# EAGLE design WaterMonitor (EAGLE 7.4.0)
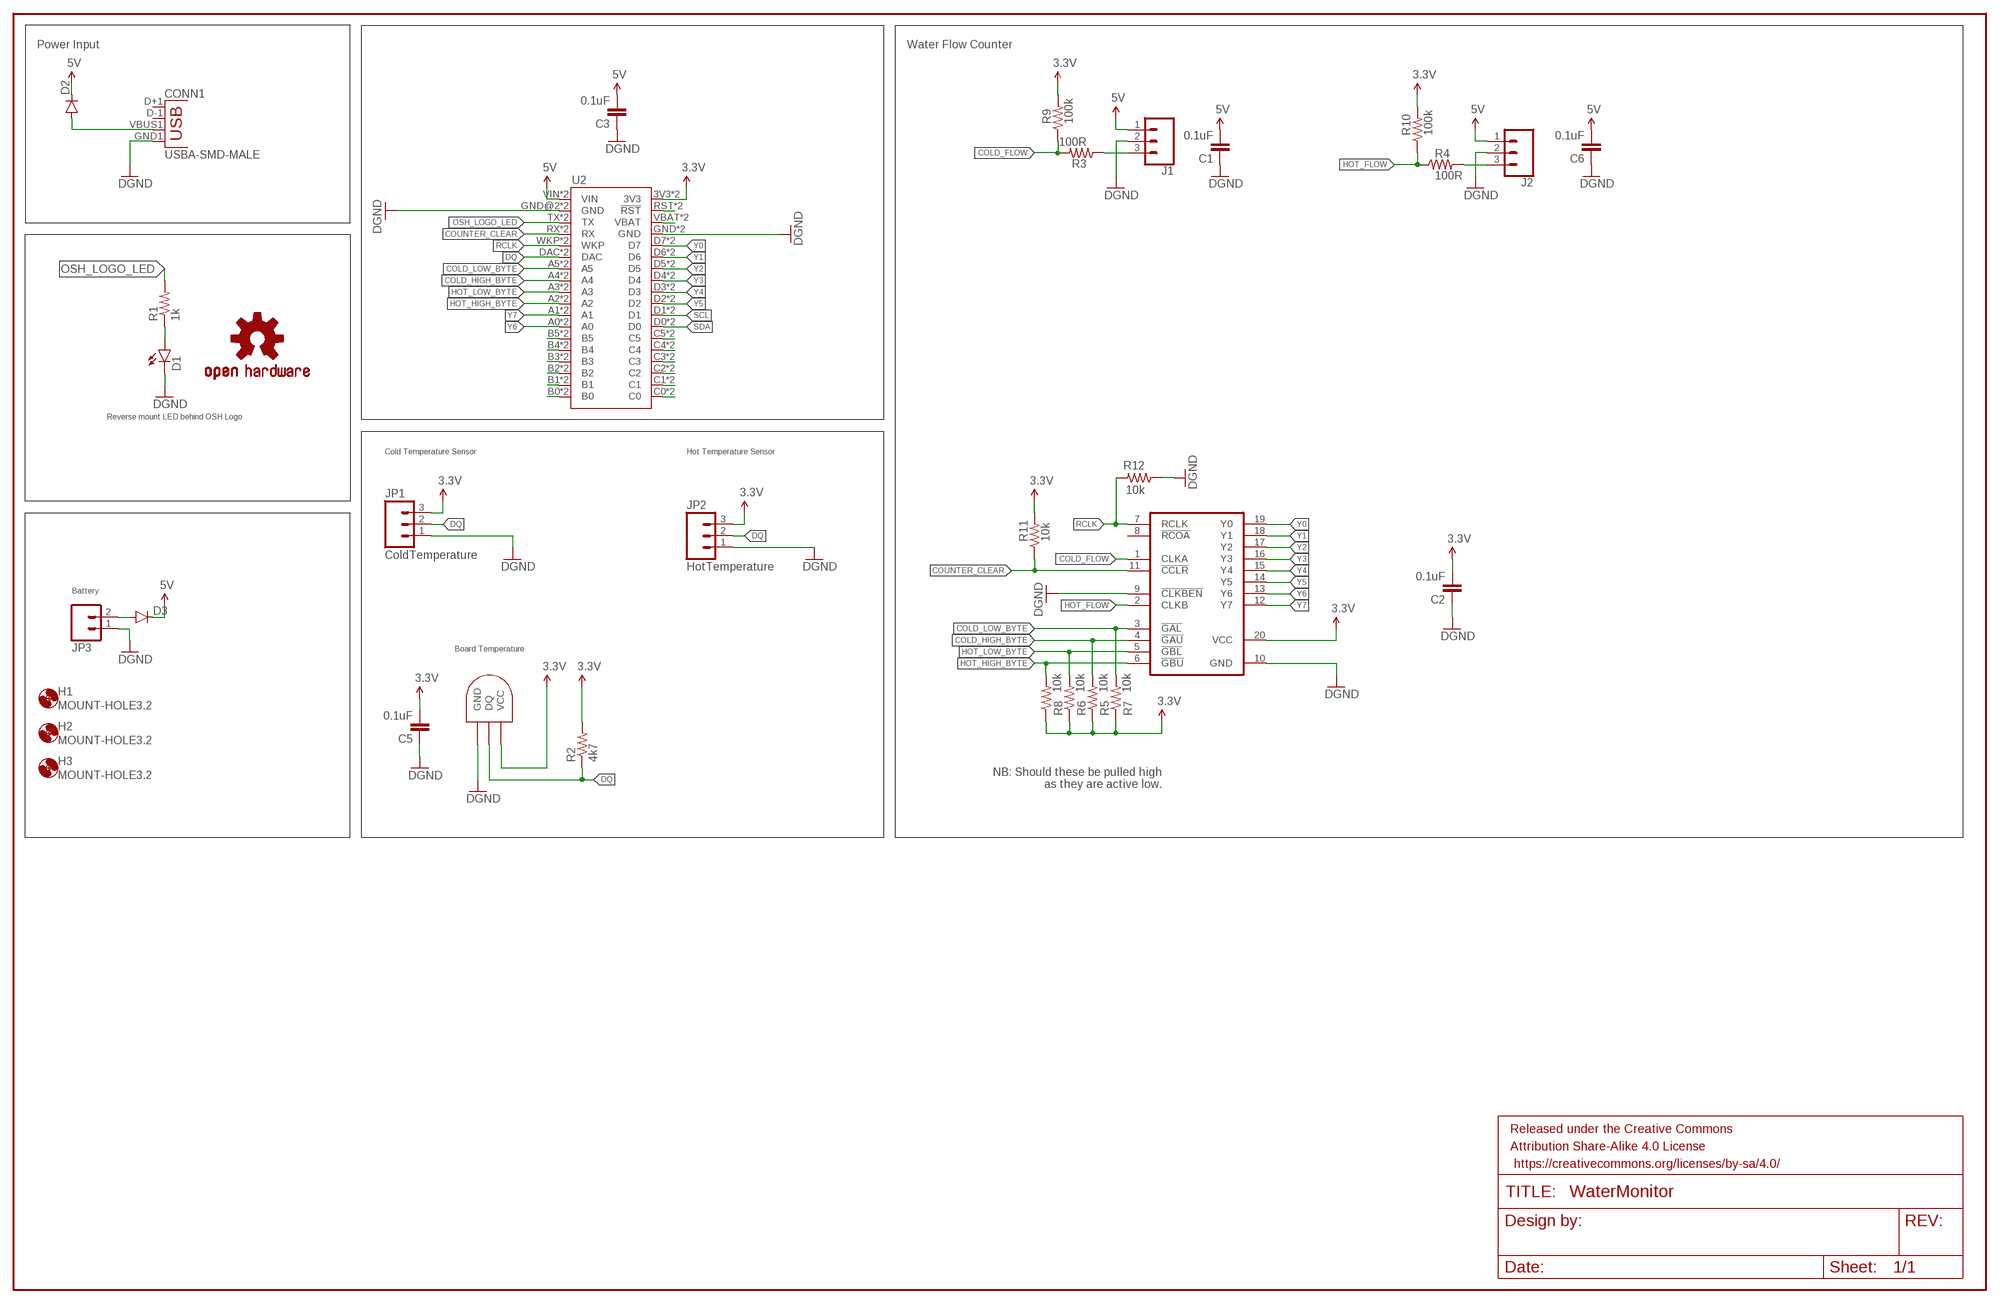
[diagram p0: schematic, sheet 1]

## Parts
C1  0.1uF  CAP0805  [0805]
C2  0.1uF  CAP0805  [0805]
C3  0.1uF  CAP0805  [0805]
C5  0.1uF  CAP0805  [0805]
C6  0.1uF  CAP0805  [0805]
CONN1  USBA-SMD-MALE  [USB-A-SMT-MALE]
D1  LED1206-BOTTOM  [LED-1206-BOTTOM]
D2  DIODESMA  [SMA-DIODE]
D3  DIODESMA  [SMA-DIODE]
FRAME2  FRAME-LEDGER  [CREATIVE_COMMONS]
H1  MOUNT-HOLE3.2  [3,2]
H2  MOUNT-HOLE3.2  [3,2]
H3  MOUNT-HOLE3.2  [3,2]
J1  CONN_03JST-HX-PTH-VERT  [JST-HX-3-PTH-VERT]
J2  CONN_03JST-HX-PTH-VERT  [JST-HX-3-PTH-VERT]
JP1  ColdTemperature  M03POLAR  [MOLEX-1X3]
JP2  HotTemperature  M03POLAR  [MOLEX-1X3]
JP3  M02-JST-2MM-SMT  [JST-2-SMD]
LOGO1  OSHW-LOGOM  [OSHW-LOGO-M]
R1  1k  RESISTOR1206  [1206]
R2  4k7  RESISTOR0805-RES  [0805]
R3  100R  RESISTOR0805-RES  [0805]
R4  100R  RESISTOR0805-RES  [0805]
R5  10k  RESISTOR0805-RES  [0805]
R6  10k  RESISTOR0805-RES  [0805]
R7  10k  RESISTOR0805-RES  [0805]
R8  10k  RESISTOR0805-RES  [0805]
R9  100k  RESISTOR0805-RES  [0805]
R10  100k  RESISTOR0805-RES  [0805]
R11  10k  RESISTOR0805-RES  [0805]
R12  10k  RESISTOR0805-RES  [0805]
U1  SN74LV8154PW  [TSSOP20]
U2  ELECTRONDUALNAMED  [ELECTRON_SIMPLE_SILK_NAMES_DUAL]
U4  DS1820SOIC  [DS18B20_SOIC]

## Nets
3.3V: C2.2 C5.2 JP1.3 JP2.3 R2.2 R5.1 R6.1 R7.1 R8.1 R9.2 R10.2 R11.2 U1.20(VCC) U2.3V3 U2.3V3_1(3V3) U4.VCC
5V: C1.2 C3.2 C6.2 D2.C D3.C J1.1 J2.1 U2.VIN U2.VIN_1B(VIN)
COLD_FLOW: R3.2 R9.1 U1.1(CLKA)
COLD_HIGH_BYTE: R5.2 U1.4(!GAU!) U2.A4 U2.A4_1(A4)
COLD_LOW_BYTE: R7.2 U1.3(!GAL!) U2.A5 U2.A5_1(A5)
COUNTER_CLEAR: R11.1 U1.11(!CCLR!) U2.RX U2.RX_1(RX)
DQ: JP1.2 JP2.2 R2.1 U2.DAC U2.DAC_1(DAC) U4.DQ
GND: C1.1 C2.1 C3.1 C5.1 C6.1 CONN1.GND1(GND) D1.C J1.2 J2.2 JP1.1 JP2.1 JP3.1 R12.1 U1.9(!CLKBEN!) U1.10(GND) U2.GND U2.GND@2(GND) U2.GND_1(GND) U2.GND_1B(GND) U4.GND ; supply symbol labelled DGND
HOT_FLOW: R4.1 R10.1 U1.2(CLKB)
HOT_HIGH_BYTE: R8.2 U1.6(!GBU!) U2.A2 U2.A2_1(A2)
HOT_LOW_BYTE: R6.2 U1.5(!GBL!) U2.A3 U2.A3_1(A3)
N$1: CONN1.VBUS1(VBUS) D2.A
N$3: J1.3 R3.1
N$4: J2.3 R4.2
N$6: U2.VBAT U2.VBATT_1(VBAT)
N$7: U2.RST(!RST) U2.RST_1(!RST)
N$21: D1.A R1.1
N$22: U2.C1 U2.C1_1(C1)
N$23: U2.C5 U2.C5_1(C5)
N$24: U2.C4 U2.C4_1(C4)
N$25: U2.C3 U2.C3_1(C3)
N$26: U2.C2 U2.C2_1(C2)
N$27: U2.C0 U2.C0_1(C0)
N$29: D3.A JP3.2
N$31: U2.B0 U2.B0_1(B0)
N$33: U2.B1 U2.B1_1(B1)
N$35: U2.B2 U2.B2_1(B2)
N$36: U2.B3 U2.B3_1(B3)
N$37: U2.B4 U2.B4_1(B4)
N$38: U2.B5 U2.B5_1(B5)
OSH_LOGO_LED: R1.2 U2.TX U2.TX_1(TX)
RCLK: R12.2 U1.7(RCLK) U2.WKP U2.WKP_1(WKP)
SCL: U2.D1 U2.D1_1(D1)
SDA: U2.D0 U2.D0_1(D0)
Y0: U1.19(Y0) U2.D7 U2.D7_1(D7)
Y1: U1.18(Y1) U2.D6 U2.D6_1(D6)
Y2: U1.17(Y2) U2.D5 U2.D5_1(D5)
Y3: U1.16(Y3) U2.D4 U2.D4_1(D4)
Y4: U1.15(Y4) U2.D3 U2.D3_1(D3)
Y5: U1.14(Y5) U2.D2 U2.D2_1(D2)
Y6: U1.13(Y6) U2.A0 U2.A0_1(A0)
Y7: U1.12(Y7) U2.A1 U2.A1_1(A1)
Unconnected: CONN1.D+1(D+) CONN1.D-1(D-) U1.8(!RCOA!)

## Notes on the sheet
- Power Input | Water Flow Counter
- Reverse mount LED behind OSH Logo
- Cold Temperature Sensor | Hot Temperature Sensor
- Battery
- Board Temperature
- NB: Should these be pulled high
  as they are active low.

## Library data of the parts
C1-C3 C5 C6 = SparkFun-Passives:CAP: Capacitor Standard 0603 ceramic capacitor, and 0.1" leaded capacitor.
CONN1 = SparkFun-Connectors:USB: USB Connectors USB-B-PTH is fully proven SKU : PRT-00139/CONN-08278 USB-miniB is fully proven SKU : PRT-00587 USB-A-PCB is untested. USB-A-H is throughly reviewed, but untested. Spark Fun Electronics SKU : PRT-00437 USB-B-SMT is throughly reviewed, but untested. Needs silkscreen touching up. USB-A-S has not been used/tested USB-MB-H has not been used/tested USB-MICROB has been used. CONN-09505
D1 = SparkFun-LED:LED: LEDs Standard schematic elements and footprints for 5mm, 3mm, 1206, and 0603 sized LEDs. 5mm - Spark Fun Electronics SKU : COM-00529 (and others)
D2 D3 = SparkFun-DiscreteSemi:DIODE: Diode These are standard reverse protection diodes and small signal diodes. SMA package can handle up to about 1A. SOD-323 can handle about 200mA. What the SOD-323 package when ordering, there are some mfgs out there that are 5-pin packages.
FRAME2 = SparkFun-Aesthetics:FRAME-LEDGER: Schematic Frame Standard 11x14 US Ledger frame
H1-H3 = holes:MOUNT-HOLE: MOUNTING HOLE with drill center marker
J1 J2 = Tinamous:CONN_03: Multi connection point. Often used as Generic Header-pin footprint for 0.1 inch spaced/style header connections On any of the 0.1 inch spaced packages, you can populate with these: Break Away Headers - Straight <https://www.sparkfun.com/products/116> (PRT-00116) Break Away Male Headers - Right Angle <https://www.sparkfun.com/products/553> (PRT-00553) Female Headers <https://www.sparkfun.com/products/115> (PRT-00115) Break Away Headers - Machine Pin <https://www.sparkfun.com/products/117> (PRT-00117) Break Away Female Headers - Swiss Machine Pin <https://www.sparkfun.com/products/743> (PRT-00743) Stackable Header - 3 Pin (Female, 0.1") <https://www.sparkfun.com/products/13875> (PRT-13875) For SCREWTERMINALS and SPRING TERMINALS visit here: Screw Terimnals on SparkFun.com <https://www.sparkfun.com/search/results?term=Screw+Terminals> (5mm/3.5mm/2.54mm spacing) This device is also useful as a general connection point to wire up your design to another part of your project. Our various solder wires solder well into these plated through hole pads. Hook-Up Wire - Assortment (Stranded, 22 AWG) <https://www.sparkfun.com/products/11375> (PRT-11375) Hook-Up Wire - Assortment (Solid Core, 22 AWG) <https://www.sparkfun.com/products/11367> (PRT-11367) View the entire wire category on our website here <https://www.sparkfun.com/categories/141> Special notes: Molex polarized connector foot print use with SKU : PRT-08232 with associated crimp pins and housings.
JP1 JP2 = SparkFun-Connectors:M03: Header 3 Standard 3-pin 0.1" header. Use with straight break away headers (SKU : PRT-00116), right angle break away headers (PRT-00553), swiss pins (PRT-00743), machine pins (PRT-00117), and female headers (PRT-00115). Molex polarized connector foot print use with SKU : PRT-08232 with associated crimp pins and housings.
JP3 = SparkFun-Connectors:M02: Standard 2-pin 0.1" header. Use with - straight break away headers ( PRT-00116) - right angle break away headers (PRT-00553) - swiss pins (PRT-00743) - machine pins (PRT-00117) - female headers (PRT-00115) Molex polarized connector foot print use with: PRT-08233 with associated crimp pins and housings. 2.54_SCREWTERM for use with PRT-10571. 3.5mm Screw Terminal footprints for PRT-08084 5mm Screw Terminal footprints for use with PRT-08432; PROD_ID: CONN-11443
LOGO1 = SparkFun-Aesthetics:OSHW-LOGO: Open Source Hardware Logo This logo indicates the piece of hardware it is found on incorporates a OSHW license and/or adheres to the definition of open source hardware found here: http://freedomdefined.org/OSHW
R1-R12 = SparkFun-Resistors:RESISTOR: Resistor Basic schematic elements and footprints for 0603, 1206, and PTH resistors.
U1 = SN74LV8154:SN74LV8154
U2 = Tinamous:ELECTRON
U4 = DS1820-SOIC:DS1820

## Board
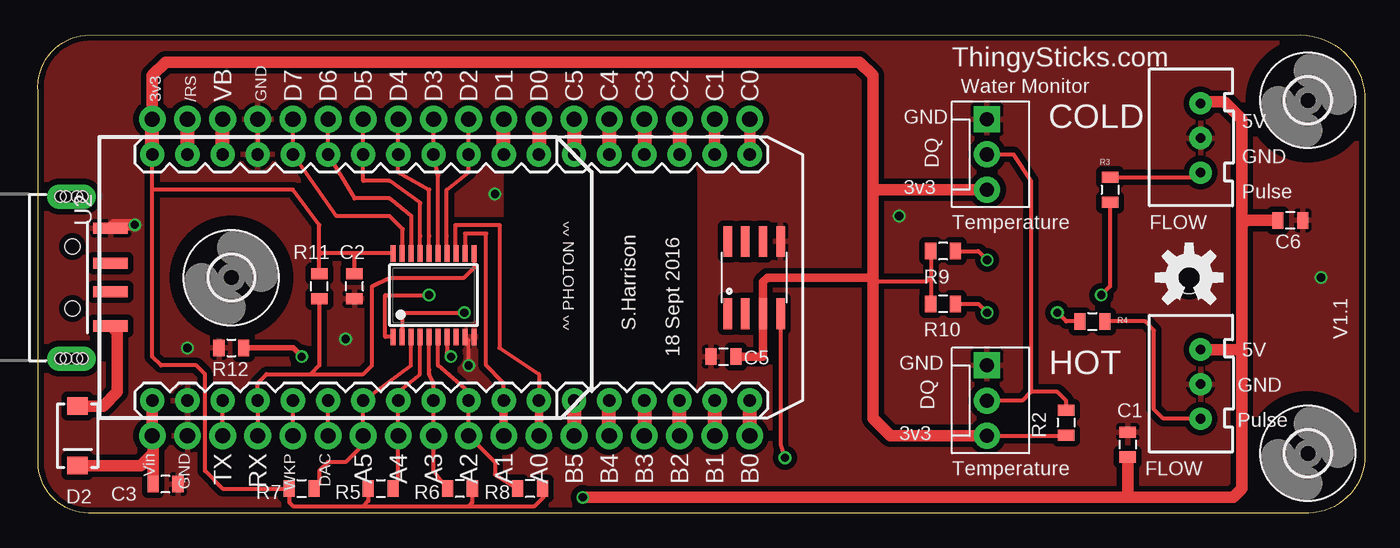
[diagram p1: board, top side]
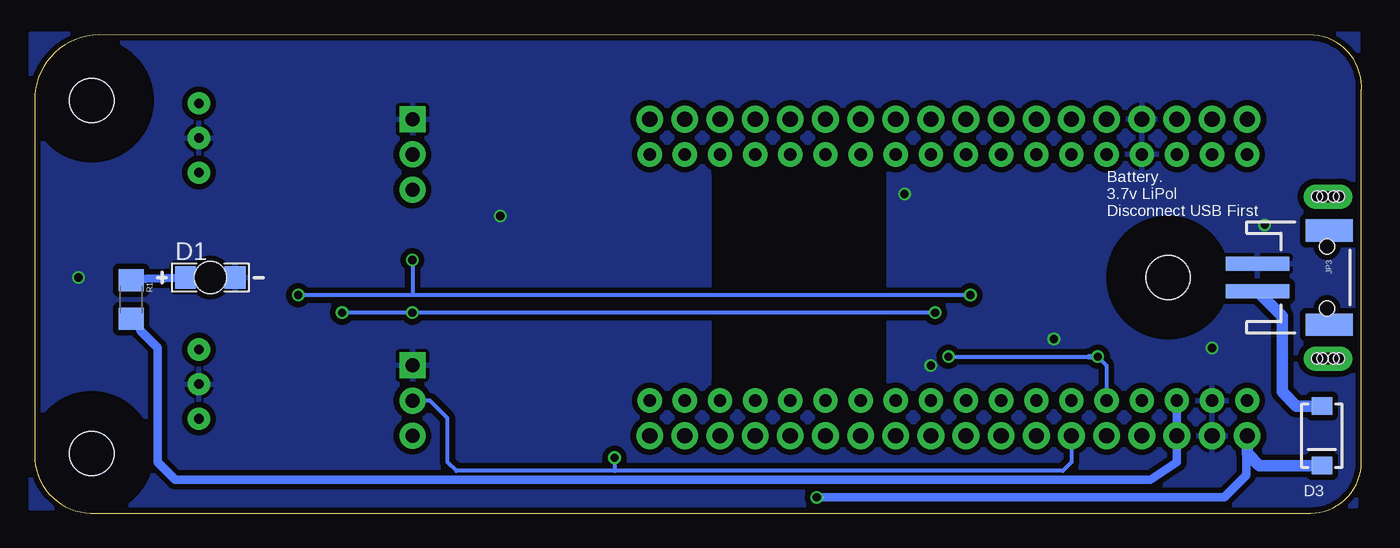
[diagram p2: board, bottom side, seen from below]

Size 95.9 x 34.56 mm. Coordinates in mm from the lower left corner, seen from the top.
Outline: 3.44,34.52 91.27,34.56 arc-90 95.9,29.71 95.9,4.19 arc-90 91.84,0 3.69,0 arc-90 0.01,3.67 0.01,30.46 arc-90 3.44,34.52
Copper layers (1*16): Top 0.035mm / dielectric 1.5mm / Bottom 0.035mm
Design rules "dirt_cheap_dirty_boards.v1": minimum track width 5mil, minimum drill 12mil, track to track 5mil, track to pad 5mil, pad to pad 5mil, via to via 5mil, smd to smd 0mil, copper to edge 10mil, drill to drill 10mil, minimum pad ring 10mil, minimum via ring 6mil, stop-mask expansion 2mil, vias tented up to drill 25mil, thermal gap 10mil
tRestrict: area 34.3,6.8 to 47,27.2
bRestrict: area 34.9,6.8 to 46.4,27.2

### Footprints (pad centres in the part's own frame; a part is rotated, then mirrored left to right if it is on the bottom)
0805 = smd 0.8 x 1.2: 1 -0.9,0; 2 0.9,0
USB-A-SMT-MALE = smd 0.8 x 2.5: D+1 1.027,-5.87; D-1 -1.027,-5.87; GND1 3.551,-5.87; VBUS1 -3.5,-5.87 | drill 0.8 pad 1.778 long: P$1 5.85,-3.05; P$3 -5.85,-3.05 | hole 1.1: 2.25,-3.12; -2.25,-3.12 | hole 0.8: -5.85,-3.45; -5.85,-3.85; -5.85,-2.65; -5.85,-2.25; 5.85,-3.45; 5.85,-3.85; 5.85,-2.65; 5.85,-2.25
LED-1206-BOTTOM = smd 1.5 x 1.6: A -1.8,0; C 1.8,0 | hole 2.3: 0,0
SMA-DIODE = smd 1.27 x 1.47: A -2.15,0; C 2.15,0
3,2 = hole 3.2: 0,0
JST-HX-3-PTH-VERT = drill 0.7 pad 1.6: 1 7.5,2.35; 2 5,2.35; 3 2.5,2.35
MOLEX-1X3 = drill 1.016 pad 1.88 square: 1 0,0 | drill 1.016 pad 1.88: 2 2.54,0; 3 5.08,0
JST-2-SMD = smd 1 x 4.6: 1 -1,-3.7; 2 1,-3.7 | smd 1.6 x 3.4: NC1 -3.4,1.5; NC2 3.4,1.5
1206 = smd 1.6 x 1.8: 1 -1.4,0; 2 1.4,0
TSSOP20 = smd 0.35 x 1.2: 1 -2.925,-3.018; 2 -2.275,-3.018; 3 -1.625,-3.018; 4 -0.975,-3.018; 5 -0.325,-3.018; 6 0.325,-3.018; 7 0.975,-3.018; 8 1.625,-3.018; 9 2.275,-3.018; 10 2.925,-3.018; 11 2.925,3.018; 12 2.275,3.018; 13 1.625,3.018; 14 0.975,3.018; 15 0.325,3.018; 16 -0.325,3.018; 17 -0.975,3.018; 18 -1.625,3.018; 19 -2.275,3.018; 20 -2.925,3.018
ELECTRON_SIMPLE_SILK_NAMES_DUAL = drill 0.889 pad 1.753: 3V3 1.27,22.86; A0 29.21,5.08; A1 26.67,5.08; A2 24.13,5.08; A3 21.59,5.08; A4 19.05,5.08; A5 16.51,5.08; B0 44.45,5.08; B1 41.91,5.08; B2 39.37,5.08; B3 36.83,5.08; B4 34.29,5.08; B5 31.75,5.08; C0 44.45,22.86; C1 41.91,22.86; C2 39.37,22.86; C3 36.83,22.86; C4 34.29,22.86; C5 31.75,22.86; D0 29.21,22.86; D1 26.67,22.86; D2 24.13,22.86; D3 21.59,22.86; D4 19.05,22.86; D5 16.51,22.86; D6 13.97,22.86; D7 11.43,22.86; DAC 13.97,5.08; GND 8.89,22.86; GND@2 3.81,5.08; RST 3.81,22.86; RX 8.89,5.08; TX 6.35,5.08; VBAT 6.35,22.86; VIN 1.27,5.08; WKP 11.43,5.08 | drill 1.1 pad 1.93: 3V3_1 1.27,25.4; A0_1 29.21,2.54; A1_1 26.67,2.54; A2_1 24.13,2.54; A3_1 21.59,2.54; A4_1 19.05,2.54; A5_1 16.51,2.54; B0_1 44.45,2.54; B1_1 41.91,2.54; B2_1 39.37,2.54; B3_1 36.83,2.54; B4_1 34.29,2.54; B5_1 31.75,2.54; C0_1 44.45,25.4; C1_1 41.91,25.4; C2_1 39.37,25.4; C3_1 36.83,25.4; C4_1 34.29,25.4; C5_1 31.75,25.4; D0_1 29.21,25.4; D1_1 26.67,25.4; D2_1 24.13,25.4; D3_1 21.59,25.4; D4_1 19.05,25.4; D5_1 16.51,25.4; D6_1 13.97,25.4; D7_1 11.43,25.4; DAC_1 13.97,2.54; GND_1 8.89,25.4; GND_1B 3.81,2.54; RST_1 3.81,25.4; RX_1 8.89,2.54; TX_1 6.35,2.54; VBATT_1 6.35,25.4; VIN_1B 1.27,2.54; WKP_1 11.43,2.54
DS18B20_SOIC = smd 0.61 x 2.21: DQ 1.905,-2.616; GND 1.905,2.616; NC -1.905,-2.616; NC2 -0.635,-2.616; NC3 -1.905,2.616; NC4 -0.635,2.616; NC5 0.635,2.616; VCC 0.635,-2.616

### Placement (x,y rotation side)
C1  78.75,4.94 270 top
C2  22.87,16.38 90 top
C3  9.22,2.09 180 top
C5  49.54,11.29 0 top
C6  90.5,21.14 180 top
CONN1  -0.62,17.01 90 top
D1  83.2,17.01 0 bottom
D2  2.87,5.58 270 top
D3  2.87,5.58 270 bottom
FRAME2  16.52,-17.92 0 top  (outside the outline)
H1  13.98,17.01 0 top
H2  91.77,4.31 0 top
H3  91.77,29.81 0 top
J1  86.37,22.09 90 top
J2  86.37,4.31 90 top
JP1  68.59,28.44 270 top
JP2  68.59,10.66 270 top
JP3  3.82,17.01 270 bottom
LOGO1  83.2,17.01 0 top
R1  88.91,15.42 270 bottom
R2  74.31,6.53 270 top
R3  77.48,23.36 270 top
R4  76.21,13.84 0 top
R5  24.78,1.77 0 top
R6  30.49,1.77 180 top
R7  19.06,1.77 0 top
R8  35.57,1.77 180 top
R9  65.42,18.91 180 top
R10  65.42,15.11 180 top
R11  20.33,16.38 90 top
R12  13.98,11.93 0 top
U1  28.59,15.74 0 top
U2  7,3.04 0 top
U4  51.77,17.01 0 top

### Tracks (layer width: path | path; a pad name or v marks a point on that pad's centre or on a via)
3.3V
  Top 0.305: 8.27,23.36 18.43,23.36 20.33,20.82 20.33,18.91 | JP2.3 74.31,5.58 R2.2 | 8.27,24.63 U2.3V3 8.27,23.36 | R9.2 64.52,17.01 | 64.52,17.01 R10.2 | 60.34,16.75 64.25,16.75 64.52,17.01 | R11.2 20.33,18.91 | 8.27,23.36 8.27,11.29 8.9,10.66 11.44,10.66 12.08,10.02 12.08,3.04 13.35,1.77 R7.1 18.16,0.76 18.43,0.5 23.51,0.5 | 23.51,0.5 31.13,0.5 | 31.13,0.5 35.89,0.5 36.53,1.13 36.53,1.72 R8.1 | R6.1 31.39,0.76 31.13,0.5 | R5.1 23.88,0.87 23.51,0.5 | U1.20 22.87,18.76 | 22.87,18.76 20.49,18.76 20.33,18.91 | C2.2 22.87,18.76
  Top 0.61: C5.2 52.4,11.29 U4.VCC 52.4,16.69 52.72,17.01 60.34,17.01
  Top 0.813: U2.3V3_1 8.27,31.61 9.22,32.57 59.39,32.57 60.34,31.61 60.34,23.36 | JP1.3 60.34,23.36 | 60.34,23.36 60.34,17.01 60.34,16.75 60.34,6.85 61.61,5.58 JP2.3
  Top 1.016: U2.3V3 U2.3V3_1
5V  (via drill 0.6)
  Top 0.813: 8.32,4.31 8.32,4.36 U2.VIN_1B U2.VIN | D3.C 7.44,3.43 8.32,4.31 | 87.01,20.82 87.01,28.44 85.74,29.71 84.14,29.71 J1.1 | 87.01,20.82 87.01,11.93 | 87.01,11.93 87.01,1.77 86.37,1.13 78.75,1.13 | 78.75,1.13 v39.38,1.13 | 8.32,4.31 C3.2 | C6.2 87.33,21.14 87.01,20.82 | C1.2 78.75,1.13 | J2.1 86.89,11.81 87.01,11.93
  Bottom 0.61: v39.38,1.13 9.91,1.13 8.32,2.72 8.32,5.53 U2.VIN_1B
  Bottom 0.813: D3.C 7.39,3.43 8.27,4.31 U2.VIN_1B
COLD_FLOW  (via drill 0.6)
  Top 0.305: U1.1 25.1,12.72 25.1,15.74 v28.27,15.74 | R9.1 67.96,18.91 v68.59,18.28 | R3.2 77.48,16.38 v76.85,15.74
  Bottom 0.305: v28.27,15.74 68.59,15.74 | 68.59,15.74 v76.85,15.74 | v68.59,18.28 68.59,15.74
COLD_HIGH_BYTE
  Top 0.305: U1.4 27.61,10.02 26.05,8.75 U2.A4 U2.A4_1 26.05,2.4 R5.2
COLD_LOW_BYTE
  Top 0.305: U1.3 26.96,10.66 U2.A5 U2.A5_1 23.51,4.94 22.24,3.67 20.97,3.67 20.33,3.04 20.33,2.14 R7.2
COUNTER_CLEAR
  Top 0.305: U2.RX_1 U2.RX 15.89,9.39 16.52,10.02 19.7,10.02 | 19.7,10.02 23.51,10.02 24.14,10.66 24.14,16.38 25.41,17.01 30.81,17.01 31.51,17.71 U1.11 | R11.1 20.33,10.66 19.7,10.02
DQ  (via drill 0.6)
  Top 0.305: JP1.2 70.5,25.9 71.77,23.99 71.77,8.75 | 71.77,8.75 71.13,8.12 JP2.2 | U2.DAC_1 U2.DAC | U4.DQ 53.67,4.94 v53.99,3.99 | R2.1 74.31,8.12 73.67,8.75 71.77,8.75
  Bottom 0.305: U2.DAC_1 20.97,3.67 21.6,3.04 53.99,3.04 | 53.99,3.04 65.42,3.04 66.05,3.67 66.05,6.85 67.32,8.12 JP2.2 | v53.99,3.99 53.99,3.04
GND  (via drill 0.6)
  Top 0.305: U2.GND_1 U2.GND | v31.13,10.66 31.13,12.46 U1.9
  Top 0.813: v7,20.82 5.51,20.82 CONN1.GND1
  other vias: 33.03,23.04 62.24,21.45 22.24,12.57 10.81,11.93 92.72,17.01
  pour Bottom (isolate 0.406, rank 6): 0.26,34.58 96.15,34.58 96.12,0.33 1.87,0.51 0.41,0.51
  pour Top (isolate 0.406, rank 6): -0.62,35.42 96.53,34.79 96.85,0.18 -0.62,0.5
HOT_FLOW  (via drill 0.6)
  Top 0.305: U1.2 26.37,12.72 26.37,14.47 v30.81,14.47 | R10.1 67.96,15.11 v68.59,14.47 | R4.1 74.31,13.84 v73.67,14.47
  Bottom 0.305: v30.81,14.47 v68.59,14.47 v73.67,14.47
HOT_HIGH_BYTE
  Top 0.305: U1.6 28.91,10.66 | 28.91,10.66 31.13,8.75 U2.A2 U2.A2_1 33.03,3.67 33.03,2.77 R8.2 | 28.91,10.66
HOT_LOW_BYTE
  Top 0.305: U1.5 28.26,10.34 28.27,10.34 28.27,10.02 28.59,9.39 U2.A3 U2.A3_1 28.59,3.04 R6.2
N$1
  Top 0.813: 5.72,13.51 CONN1.VBUS1 5.73,13.03 5.73,8.75 4.7,7.73 D2.A
N$3
  Top 0.305: R3.1 83.69,24.26 J1.3
N$4
  Top 0.305: J2.3 81.33,6.81 80.66,7.48 80.66,13.2 80.02,13.84 R4.2
N$6
  Top 1.016: U2.VBAT U2.VBATT_1
N$7
  Top 1.016: U2.RST U2.RST_1
N$21
  Bottom 0.61: R1.1 87.83,16.93 D1.A
N$22
  Top 0.813: U2.C1_1 U2.C1
N$23
  Top 1.016: U2.C5_1 U2.C5
N$24
  Top 1.016: U2.C4_1 U2.C4
N$25
  Top 1.016: U2.C3_1 U2.C3
N$26
  Top 1.016: U2.C2_1 U2.C2
N$27
  Top 0.813: U2.C0_1 U2.C0
N$29
  Bottom 0.813: D3.A 4.7,7.73 5.73,8.75 5.73,14.21 JP3.2
N$31
  Top 1.016: U2.B0_1 U2.B0
N$33
  Top 1.016: U2.B1 U2.B1_1
N$35
  Top 1.016: U2.B2_1 U2.B2
N$36
  Top 1.016: U2.B3 U2.B3_1
N$37
  Top 1.016: U2.B4_1 U2.B4
N$38
  Top 1.016: U2.B5 U2.B5_1
OSH_LOGO_LED
  Top 0.305: U2.TX_1 U2.TX
  Bottom 0.305: 88.28,13.2 R1.2
  Bottom 0.61: U2.TX 13.35,3.67 15.25,2.4 85.74,2.4 87.01,3.67 87.01,11.93 88.28,13.2 | 88.91,13.7 R1.2
RCLK  (via drill 0.6)
  Top 0.305: U2.WKP_1 U2.WKP | U1.7 29.56,11.59 v29.86,11.29
  Top 0.406: R12.2 18.43,11.93 v19.06,11.29
  Bottom 0.305: v29.86,11.29 19.7,11.29 | v19.06,11.29 18.43,10.66 U2.WKP
  Bottom 0.406: v19.06,11.29 19.7,11.29
SCL
  Top 1.016: U2.D1 U2.D1_1
SDA
  Top 1.016: U2.D0_1 U2.D0
Y0
  Top 0.305: U1.19 26.37,18.76 26.37,20.5 25.41,21.45 21.6,21.45 U2.D7 U2.D7_1
Y1
  Top 0.305: U1.18 27,18.76 27,21.45 25.41,22.72 22.87,22.72 U2.D6 U2.D6_1
Y2
  Top 0.305: U1.17 27.64,20.03 27.64,22.41 25.41,23.99 23.51,23.99 U2.D5 U2.D5_1
Y3
  Top 0.305: U1.16 28.27,20.03 28.27,23.36 26.05,24.63 U2.D4 U2.D4_1
Y4
  Top 0.305: U1.15 28.91,20.03 28.91,24.31 | 28.91,24.63 28.91,24.31 | 28.91,24.31 U2.D3 U2.D3_1
Y5
  Top 0.305: U1.14 29.54,20.03 29.54,23.36 31.13,24.63 U2.D2 U2.D2_1
Y6
  Top 0.305: U1.13 30.18,18.76 30.18,20.82 33.35,20.82 33.35,11.93 36.21,10.02 U2.A0
  Top 0.61: U2.A0_1 U2.A0
Y7
  Top 0.305: U2.A1 33.67,9.39 32.4,10.66 32.4,20.18 30.86,20.18 U1.12
  Top 0.61: U2.A1_1 U2.A1

### Text on the board
tNames: ThingySticks.com | Water Monitor | GND | COLD | 5V | DQ | GND | 3v3 | Pulse | Temperature | FLOW | ^^ PHOTON ^^ | S.Harrison | V1.1 | 18 Sept 2016 | 5V | GND | HOT | GND | DQ | Pulse | 3v3 | Temperature | FLOW
bNames: Battery. / 3.7v LiPol / Disconnect USB First